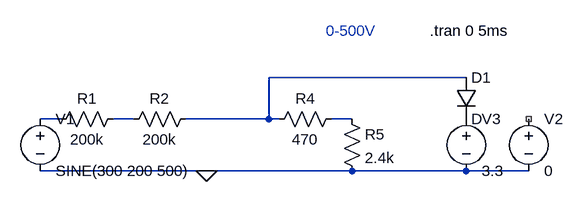
[diagram p0: schematic volt.asc]
volt.asc, the LTspice schematic file:
Version 4
SHEET 1 892 680
WIRE 736 224 432 224
WIRE 112 288 80 288
WIRE 224 288 192 288
WIRE 432 288 432 224
WIRE 432 288 304 288
WIRE 448 288 432 288
WIRE 560 288 528 288
WIRE 336 368 80 368
WIRE 560 368 336 368
WIRE 736 368 560 368
WIRE 832 368 736 368
FLAG 336 368 0
SYMBOL voltage 80 272 R0
SYMATTR InstName V1
SYMATTR Value SINE(300 200 500)
SYMBOL res 208 272 R90
WINDOW 0 0 56 VBottom 2
WINDOW 3 32 56 VTop 2
SYMATTR InstName R1
SYMATTR Value 200k
SYMBOL res 320 272 R90
WINDOW 0 0 56 VBottom 2
WINDOW 3 32 56 VTop 2
SYMATTR InstName R2
SYMATTR Value 200k
SYMBOL voltage 736 272 R0
SYMATTR InstName V3
SYMATTR Value 3.3
SYMBOL res 544 272 R90
WINDOW 0 0 56 VBottom 2
WINDOW 3 32 56 VTop 2
SYMATTR InstName R4
SYMATTR Value 470
SYMBOL res 544 272 R0
SYMATTR InstName R5
SYMATTR Value 2.4k
SYMBOL voltage 832 272 R0
SYMATTR InstName V2
SYMATTR Value 0
SYMBOL diode 720 224 R0
SYMATTR InstName D1
TEXT 680 152 Left 2 !.tran 0 5ms
TEXT 520 152 Left 2 ;0-500V

The netlist it stands for:
* volt.asc
V1 N002 0 SINE(300 200 500)
R1 N003 N002 200k
R2 N001 N003 200k
V3 P001 0 3.3
R4 N004 N001 470
R5 N004 0 2.4k
V2 NC_01 0 0
D1 N001 P001 D
.model D D
.lib standard.dio
.tran 0 5ms
* 0-500V
.backanno
.end